# Altium schematic sheet cjb.SchDoc: Top
size A4; SheetNumber: 1; SheetTotal: 6
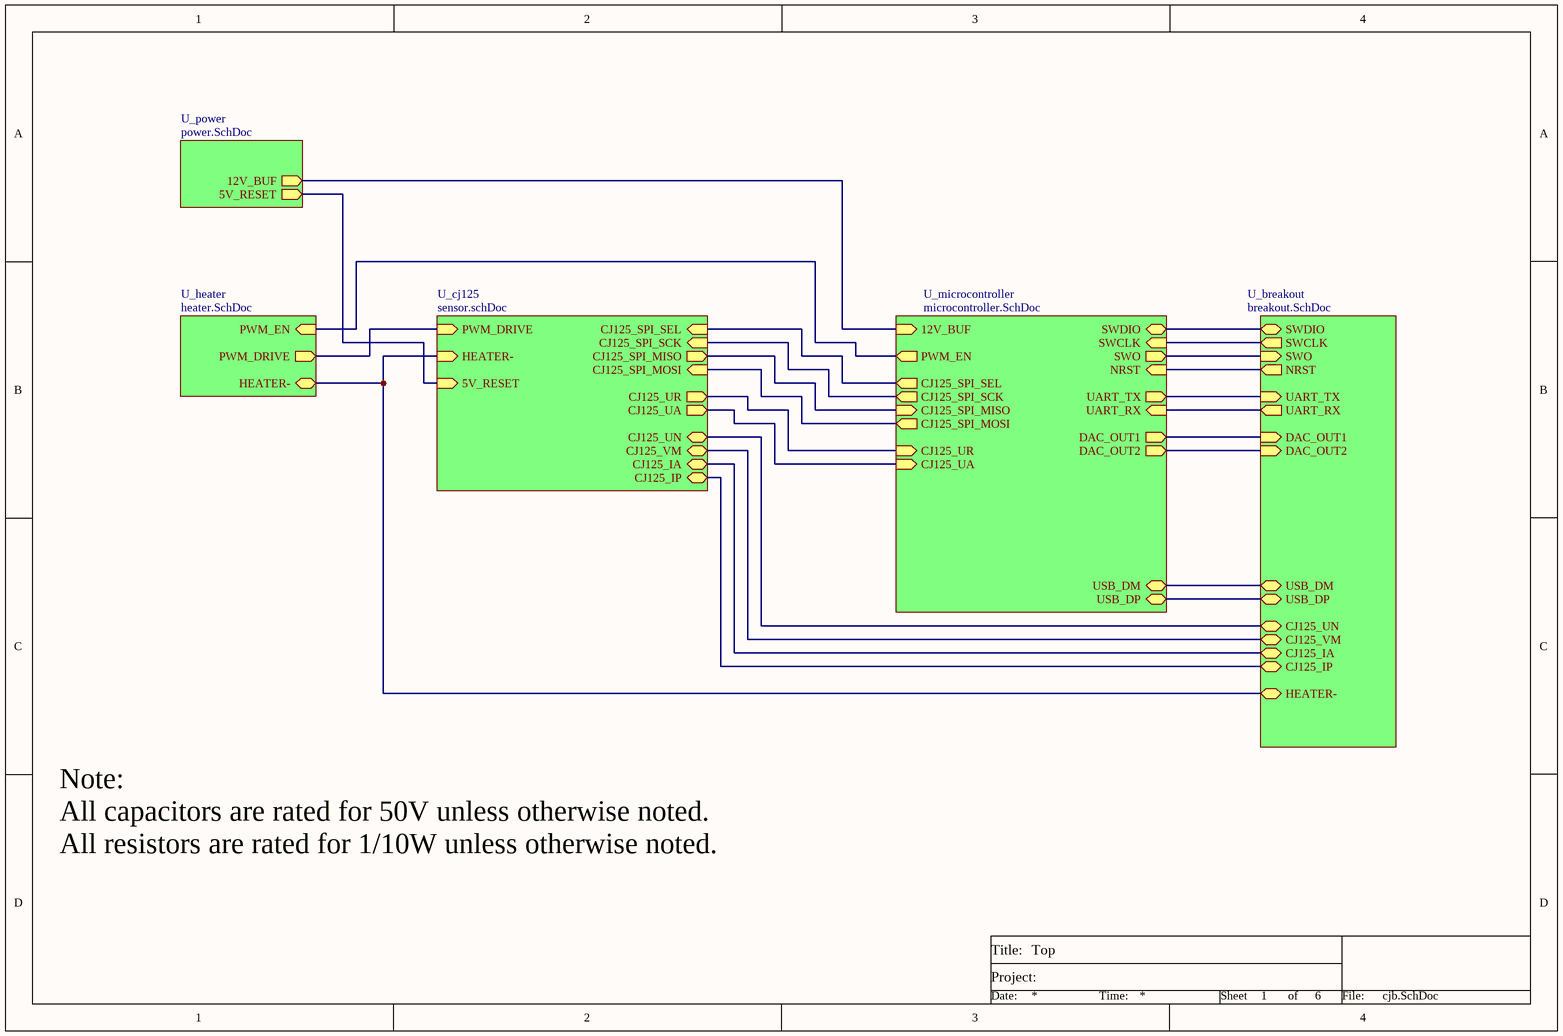
[diagram p0: cjb.SchDoc]

## Sub-sheets
U_breakout = breakout.SchDoc: SWDIO (bidir), SWCLK (out), SWO (in), NRST (out), DAC_OUT1 (in), DAC_OUT2 (in), UART_TX (in), UART_RX (out), HEATER- (bidir), CJ125_IP (bidir), CJ125_IA (bidir), CJ125_VM (bidir), CJ125_UN (bidir), USB_DM (bidir), USB_DP (bidir)
U_cj125 = sensor.schDoc: CJ125_SPI_SCK (in), CJ125_SPI_MISO (out), CJ125_SPI_MOSI (in), CJ125_SPI_SEL (in), CJ125_IP (bidir), CJ125_UA (out), CJ125_UN (bidir), CJ125_IA (bidir), CJ125_VM (bidir), CJ125_UR (out), HEATER- (in), PWM_DRIVE (in), 5V_RESET (in)
U_heater = heater.SchDoc: HEATER- (bidir), PWM_DRIVE (out), PWM_EN (in)
U_microcontroller = microcontroller.SchDoc: SWDIO (bidir), SWCLK (in), SWO (out), NRST (in), DAC_OUT1 (out), DAC_OUT2 (out), UART_TX (out), UART_RX (in), CJ125_SPI_SCK (out), CJ125_SPI_MISO (in), CJ125_SPI_MOSI (out), CJ125_SPI_SEL (out), CJ125_UA (in), CJ125_UR (in), 12V_BUF (in), PWM_EN (out), USB_DM (bidir), USB_DP (bidir)
U_power = power.SchDoc: 5V_RESET (out), 12V_BUF (out)

## Nets
(unnamed): sheet U_power/5V_RESET, sheet U_cj125/5V_RESET
(unnamed): sheet U_power/12V_BUF, sheet U_microcontroller/12V_BUF
(unnamed): sheet U_microcontroller/SWDIO, sheet U_breakout/SWDIO
(unnamed): sheet U_microcontroller/SWCLK, sheet U_breakout/SWCLK
(unnamed): sheet U_microcontroller/SWO, sheet U_breakout/SWO
(unnamed): sheet U_microcontroller/NRST, sheet U_breakout/NRST
(unnamed): sheet U_microcontroller/DAC_OUT1, sheet U_breakout/DAC_OUT1
(unnamed): sheet U_microcontroller/DAC_OUT2, sheet U_breakout/DAC_OUT2
(unnamed): sheet U_microcontroller/UART_TX, sheet U_breakout/UART_TX
(unnamed): sheet U_microcontroller/UART_RX, sheet U_breakout/UART_RX
(unnamed): sheet U_microcontroller/CJ125_SPI_SCK, sheet U_cj125/CJ125_SPI_SCK
(unnamed): sheet U_microcontroller/CJ125_SPI_MISO, sheet U_cj125/CJ125_SPI_MISO
(unnamed): sheet U_microcontroller/CJ125_SPI_MOSI, sheet U_cj125/CJ125_SPI_MOSI
(unnamed): sheet U_microcontroller/CJ125_SPI_SEL, sheet U_cj125/CJ125_SPI_SEL
(unnamed): sheet U_microcontroller/CJ125_UA, sheet U_cj125/CJ125_UA
(unnamed): sheet U_microcontroller/CJ125_UR, sheet U_cj125/CJ125_UR
(unnamed): sheet U_microcontroller/PWM_EN, sheet U_heater/PWM_EN
(unnamed): sheet U_microcontroller/USB_DM, sheet U_breakout/USB_DM
(unnamed): sheet U_microcontroller/USB_DP, sheet U_breakout/USB_DP
(unnamed): sheet U_breakout/HEATER-, sheet U_cj125/HEATER-, sheet U_heater/HEATER-
(unnamed): sheet U_breakout/CJ125_IP, sheet U_cj125/CJ125_IP
(unnamed): sheet U_breakout/CJ125_IA, sheet U_cj125/CJ125_IA
(unnamed): sheet U_breakout/CJ125_VM, sheet U_cj125/CJ125_VM
(unnamed): sheet U_breakout/CJ125_UN, sheet U_cj125/CJ125_UN
(unnamed): sheet U_cj125/PWM_DRIVE, sheet U_heater/PWM_DRIVE

## Notes on the sheet
- Note:
  All capacitors are rated for 50V unless otherwise noted.
  All resistors are rated for 1/10W unless otherwise noted.
- Title
- Title:
- Project:
- Size:
- Date:
- File:
- E
- Number:
- Time:
- Revision:
- Sheet
- of